# Altium project WirelessMonitor.PrjPcb
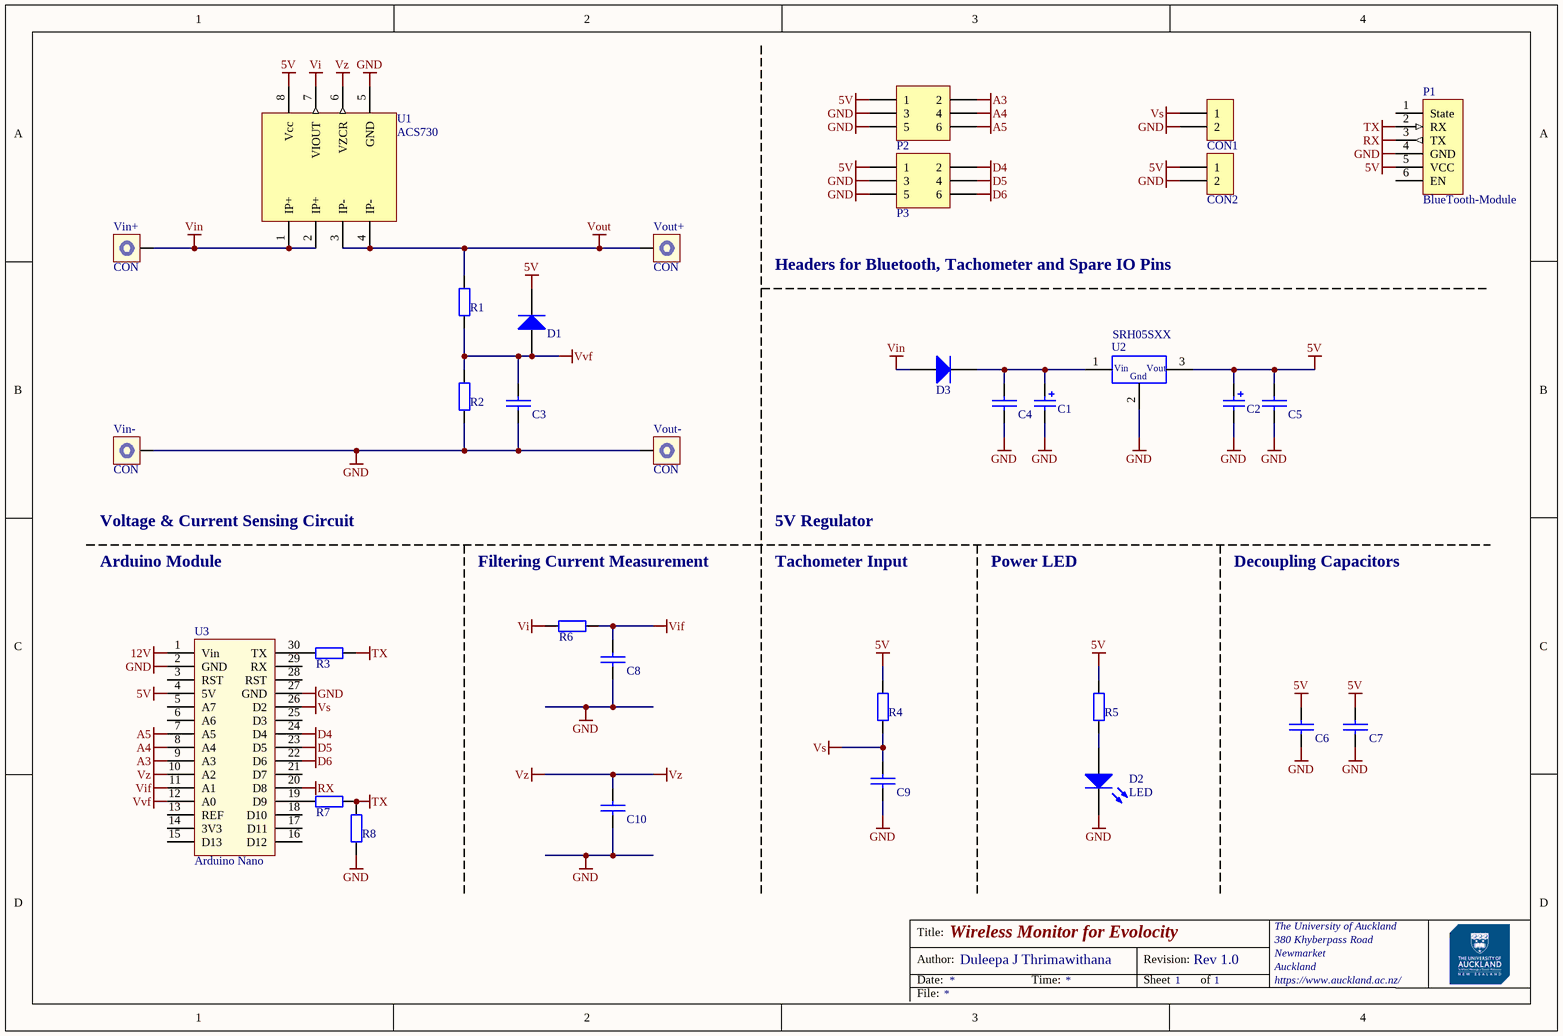
[diagram p0: WirelessMonitorSch.SchDoc]
1 sheet, 33 parts. Net scope: global (net labels, ports and power ports of the same name join across sheets).
Board file: WirelessMonitorPCB.PcbDoc

## Sheet WirelessMonitorSch.SchDoc: Wireless Monitor for Evolocity
size A4; Author: Duleepa J Thrimawithana; Organization: The University of Auckland; Address1: 380 Khyberpass Road; Address2: Newmarket; Address3: Auckland; Address4: https://www.auckland.ac.nz/; Revision: Rev 1.0; SheetNumber: 1; SheetTotal: 1

### Parts
C1  ECAP  [CR05]  (value not drawn)
C2  ECAP  [CR015]  (value not drawn)
C3  Film Cap  [CB05]  (value not drawn)
C4  Film Cap  [CB05]  (value not drawn)
C5  Film Cap  [CB05]  (value not drawn)
C6  Film Cap  [CB05]  (value not drawn)
C7  Film Cap  [CB05]  (value not drawn)
C8  Film Cap  [CB05]  (value not drawn)
C9  Film Cap  [CB05]  (value not drawn)
C10  Film Cap  [CB05]  (value not drawn)
CON1  Header 2X1  [HDR2X1_2P54]  (value not drawn)
CON2  Header 2X1  [HDR2X1_2P54]  (value not drawn)
D1  Diode  [DAX4]  (value not drawn)
D2  LED  [LEDTH]
D3  Diode  [DAX4]  (value not drawn)
P1  BlueTooth-Module  [HDRBLE]
P2  HDR3X2  [HDR2X3_2P54]  (value not drawn)
P3  HDR3X2  [HDR2X3_2P54]  (value not drawn)
R1  Resistor  [RAX4]  (value not drawn)
R2  Resistor  [RAX4]  (value not drawn)
R3  Resistor  [RAX4]  (value not drawn)
R4  Resistor  [RAX4]  (value not drawn)
R5  Resistor  [RAX4]  (value not drawn)
R6  Resistor  [RAX4]  (value not drawn)
R7  Resistor  [RAX4]  (value not drawn)
R8  Resistor  [RAX4]  (value not drawn)
U1  ACS730  [SOIC8]
U2  SRH05SXX  [SRH05]
U3  Arduino Nano  [ArduinoNano]
Vin+  CON  [CON_M3]
Vin-  CON  [CON_M3]
Vout+  CON  [CON_M3]
Vout-  CON  [CON_M3]

### Nets
5V: C2.1 C5.2 C6.2 C7.2 CON2.1 D1.2 P1.5(VCC) P2.1 P3.1 R4.2 R5.2 U1.8(Vcc) U2.3(Vout) U3.4(5V)
12V: U3.1(Vin)
A3: P2.2 U3.9(A3)
A4: P2.4 U3.8(A4)
A5: P2.6 U3.7(A5)
D4: P3.2 U3.24(D4)
D5: P3.4 U3.23(D5)
D6: P3.6 U3.22(D6)
GND: C1.2 C2.2 C3.1 C4.1 C5.1 C6.1 C7.1 C8.1 C9.1 C10.1 CON1.2 CON2.2 D2.2(K) P1.4(GND) P2.3 P2.5 P3.3 P3.5 R2.1 R8.2 U1.5(GND) U2.2(Gnd) U3.2(GND) U3.27(GND) Vin-.1 Vout-.1
RX: P1.3(TX) U3.20(D8)
TX: P1.2(RX) R3.1 R7.1 R8.1
Vi: R6.2 U1.7(VIOUT)
Vif: C8.2 R6.1 U3.11(A1)
Vin: D3.1 U1.1(IP+) U1.2(IP+) Vin+.1
Vout: R1.2 U1.3(IP-) U1.4(IP-) Vout+.1
Vs: C9.2 CON1.1 R4.1 U3.26(D2)
Vvf: C3.2 D1.1 R1.1 R2.2 U3.12(A0)
Vz: C10.2 U1.6(VZCR) U3.10(A2)
NetC1_1: C1.1 C4.2 D3.2 U2.1(Vin)
NetD2_1: D2.1(A) R5.1
NetR3_2: R3.2 U3.30(TX)
NetR7_2: R7.2 U3.19(D9)

Not connected (* = marked no-connect by the designer): P1 1(State) 6(EN); U3 3(RST) 5(A7) 6(A6) 13(REF) 14(3V3) 15(D13) 16(D12) 17(D11) 18(D10) 21(D7) 25(D3) 28(RST) 29(RX)

### Notes on the sheet
- Headers for Bluetooth, Tachometer and Spare IO Pins
- Voltage & Current Sensing Circuit
- Arduino Module
- Filtering Current Measurement
- Tachometer Input
- 5V Regulator
- Power LED
- Decoupling Capacitors
- Title:
- Author:
- Date:
- Time:
- Revision:
- Sheet
- of
- File:

### Library data of the parts
C3-C10 = FCAPAX5: Film Cap Ax5
CON1 CON2 = HDR2X1
P1 = HM10_Module: Header, 6-Pin; LatestRevisionDate: 17-Jul-2002; LatestRevisionNote: Re-released for DXP Platform.; Publisher: Altium Limited
P2 P3 = HDR3X2: Header, 3-Pin, Dual row
R1-R8 = RESAX4: Axial Resistor
U2 = SRH05SXX: SRH05 Series Wing Input Range Regulators; Supplier 1: Digi-Key; Supplier Part Number 1: 1470-4531-ND
U3 = ArduinoNano
Vin+ Vin- Vout+ Vout- = Connector: Term; Part Number: 74651194R; Rated Current: 85 A; Published Date: Jan 2017; Publisher: Wurth Elektronik; Size: M4, thread 5mm; Packaging: Tape and Reel
U1 = ACS730: Supplier 1: Digikey; Supplier Part Number 1: 620-1794-6-ND